# EAGLE schematic DDS_prototype (EAGLE 9.4.2)

## Sheet 1 of 2
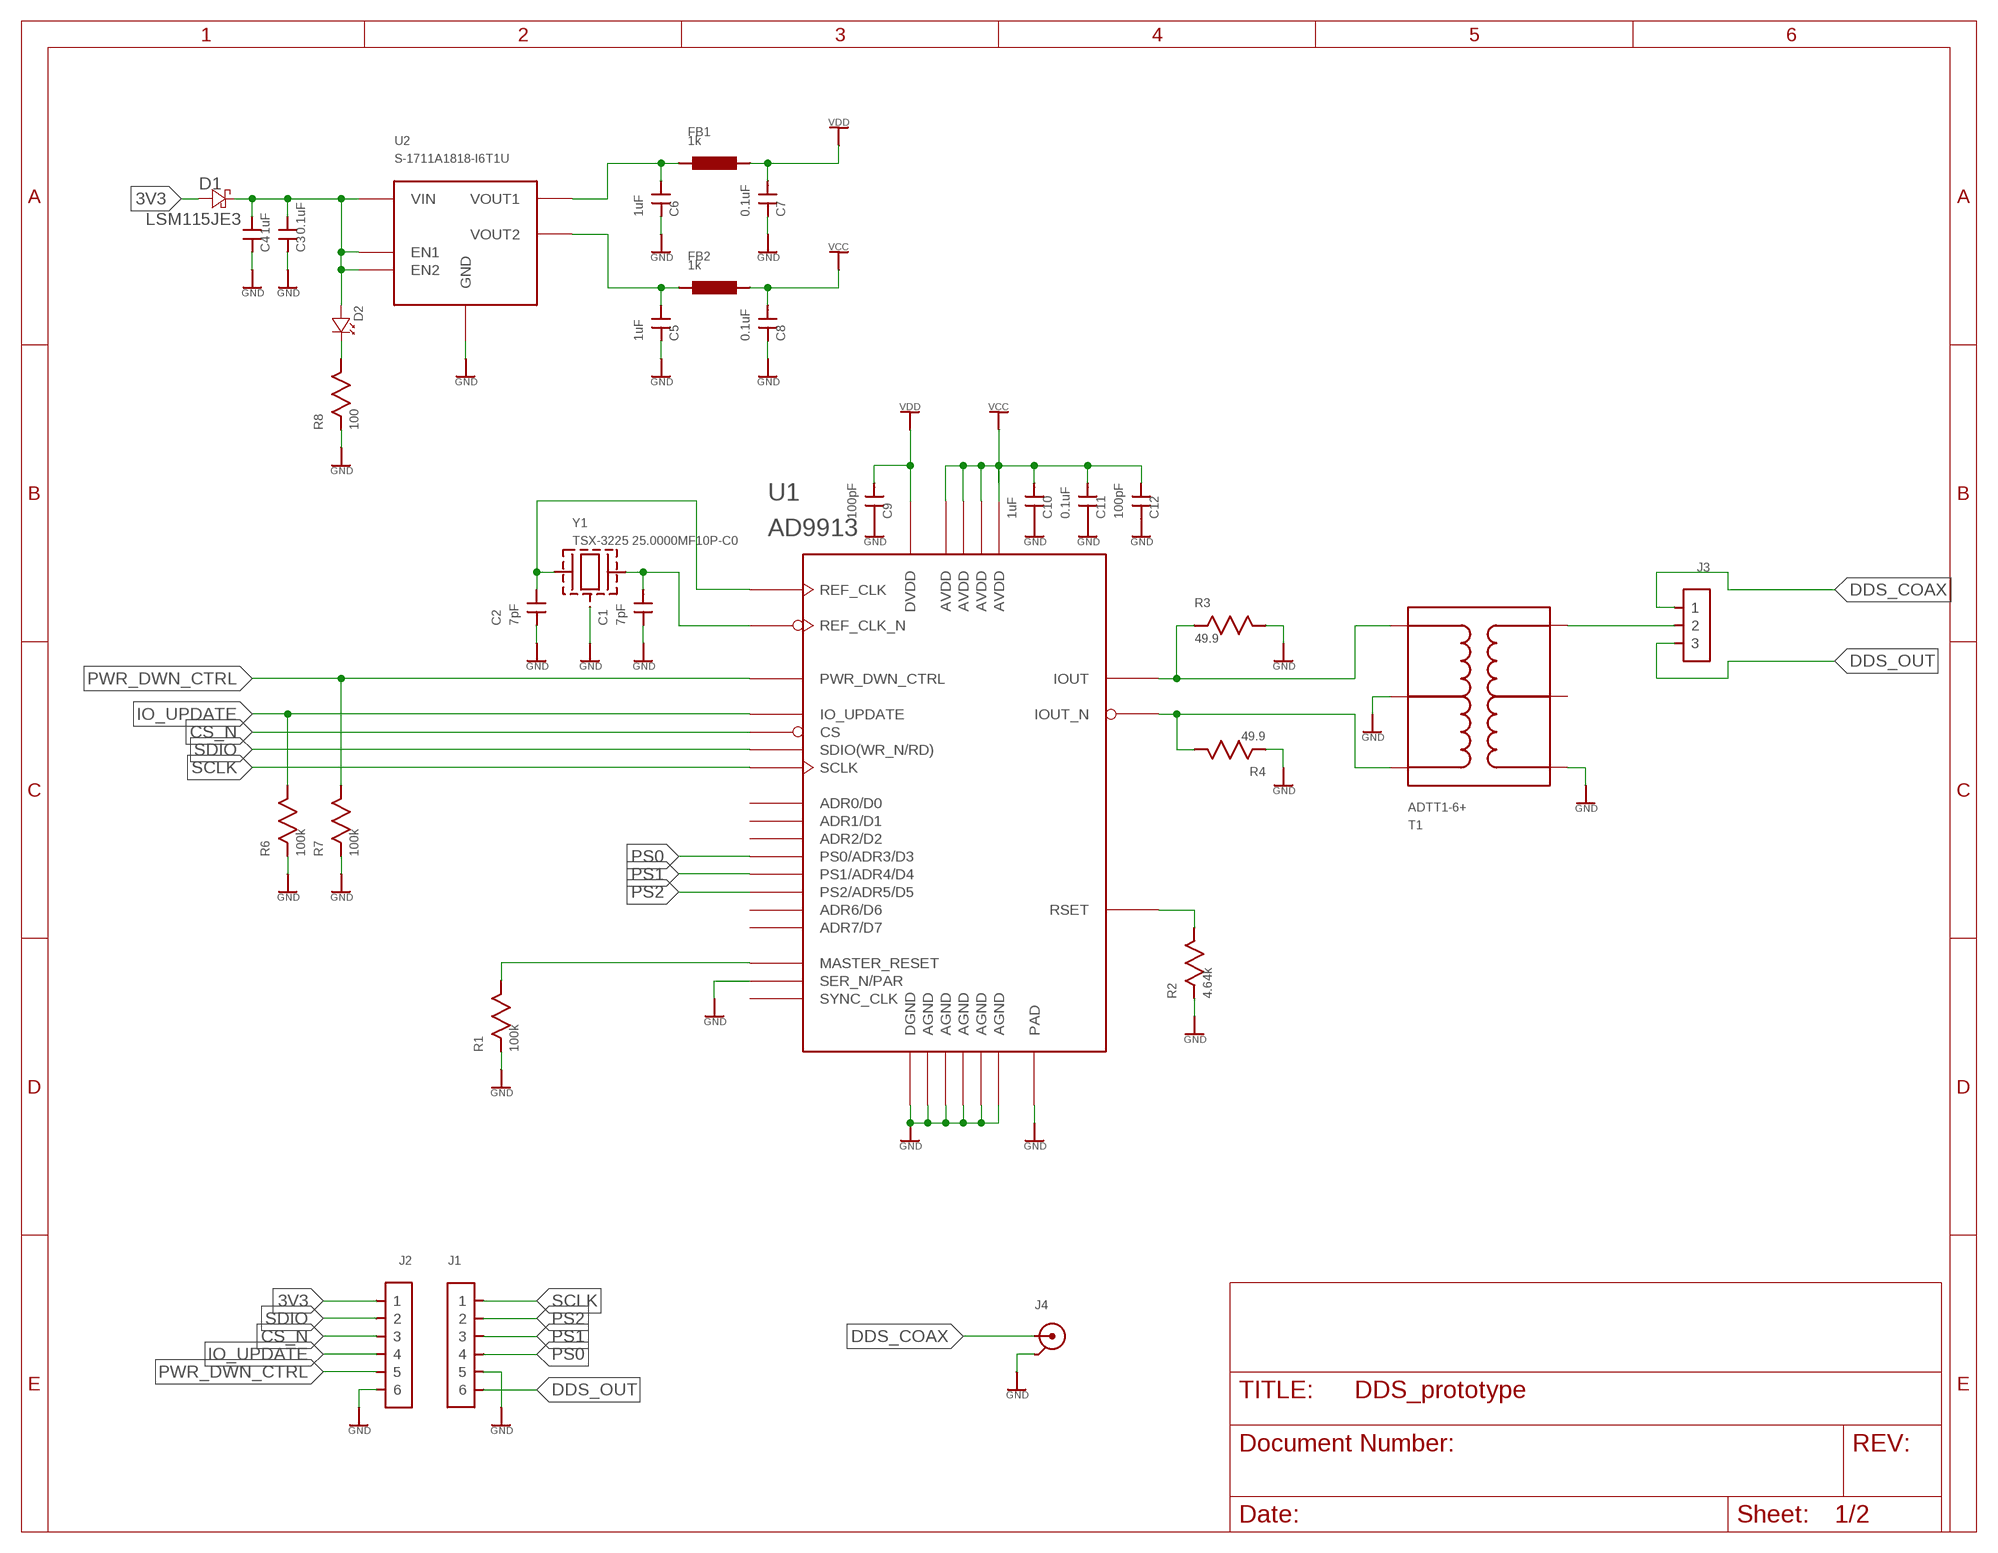
[diagram p0: schematic, sheet 1]

### Parts
C1  7pF  CC0402DRNPO9BN7R0  [0402]
C2  7pF  CC0402DRNPO9BN7R0  [0402]
C3  0.1uF  CC0402KRX5R7BB104  [0402]
C4  1uF  CC0402KRX5R7BB105  [0402]
C5  1uF  CC0402KRX5R7BB105  [0402]
C6  1uF  CC0402KRX5R7BB105  [0402]
C7  0.1uF  CC0402KRX5R7BB104  [0402]
C8  0.1uF  CC0402KRX5R7BB104  [0402]
C9  100pF  CC0402JRNPO9BN101  [0402]
C10  1uF  CC0402KRX5R7BB105  [0402]
C11  0.1uF  CC0402KRX5R7BB104  [0402]
C12  100pF  CC0402JRNPO9BN101  [0402]
D1  LSM115JE3  LSM115JE3/TR13  [DO-214BA]
D2  QBLP595-IG  [0402_GREEN]
FB1  1k  BLM18KG102SN1D  [0603]
FB2  1k  BLM18KG102SN1D  [0603]
J1  1X6_MALE_HEADER_0.1  [1X6_MALE_HEADER_0.1]
J2  1X6_MALE_HEADER_0.1  [1X6_MALE_HEADER_0.1]
J3  1X3_MALE_HEADER_0.1  [1X3_MALE_HEADER_0.1]
J4  SMA_EMPCB.SMAFSTJ.B.HT  [EMPCB.SMAFSTJ.B.HT]
R1  100k  RC0402JR-07100KL  [0402]
R2  4.64k  RC0402FR-074K64L  [0402]
R3  49.9  RC0402FR-0749R9L  [0402]
R4  49.9  RC0402FR-0749R9L  [0402]
R6  100k  RC0402JR-07100KL  [0402]
R7  100k  RC0402JR-07100KL  [0402]
R8  100  RC0402JR-07100RL  [0402]
T1  ADTT1-6+  [CD637]
U1  AD9913  [32-LFCSP]
U2  S-1711A1818-I6T1U  S-1711  [SNT-6A]
Y1  TSX-3225 25.0000MF10P-C0  TSX-322525.0000MF10P-C0  [TSX-3225]

### Nets
3V3: D1.A J2.P$1
3V3_PROT: C3.2 C4.2 D1.K D2.A U2.P2(VIN) U2.P4(EN2) U2.P6(EN1)
CS_N: J2.P$3 U1.P$28(CS)
DDS: J3.P$2 T1.P$4
DDS_COAX: J3.P$1 J4.P$1
DDS_OUT: J1.P$6 J3.P$3
GND: C1.1 C2.1 C3.1 C4.1 C5.1 C6.1 C7.1 C8.1 C9.1 C10.1 C11.1 C12.1 J1.P$5 J2.P$6 J4.P$2 J4.P$3 J4.P$4 J4.P$5 R1.P$1 R2.P$1 R3.P$2 R4.P$1 R6.P$1 R7.P$1 R8.P$1 T1.P$2 T1.P$6 U1.P$5(DGND) U1.P$10(SER_N/PAR) U1.P$11(AGND) U1.P$15(AGND) U1.P$18(AGND) U1.P$21(AGND) U1.P$23(AGND) U1.P$33(PAD) U2.P5(GND) Y1.P2 Y1.P4
IO_UPDATE: J2.P$4 R6.P$2 U1.P$27(IO_UPDATE)
IOUT: R3.P$1 T1.P$3 U1.P$19(IOUT)
IOUT_N: R4.P$2 T1.P$1 U1.P$20(IOUT_N)
MSTR_RST: R1.P$2 U1.P$25(MASTER_RESET)
N$1: D2.K R8.P$2
N$7: C1.2 U1.P$14(REF_CLK_N) Y1.P3
N$14: C2.2 U1.P$13(REF_CLK) Y1.P1
PS0: J1.P$4 U1.P$3(PS0/ADR3/D3)
PS1: J1.P$3 U1.P$2(PS1/ADR4/D4)
PS2: J1.P$2 U1.P$1(PS2/ADR5/D5)
PWR_DWN_CTRL: J2.P$5 R7.P$2 U1.P$26(PWR_DWN_CTRL)
RSET: R2.P$2 U1.P$24(RSET)
SCLK: J1.P$1 U1.P$30(SCLK)
SDIO: J2.P$2 U1.P$29(SDIO(WR_N/RD))
VCC: C8.2 C10.2 C11.2 C12.2 FB2.P$2 U1.P$12(AVDD) U1.P$16(AVDD) U1.P$17(AVDD) U1.P$22(AVDD)
VCC_UNFILT: C6.2 FB1.P$1 U2.P1(VOUT1)
VDD: C7.2 C9.2 FB1.P$2 U1.P$4(DVDD)
VDD_UNFILT: C5.2 FB2.P$1 U2.P3(VOUT2)
Unconnected: T1.P$5 U1.P$6(ADR2/D2) U1.P$7(ADR1/D1) U1.P$8(ADR0/D0) U1.P$9(SYNC_CLK) U1.P$31(ADR7/D7) U1.P$32(ADR6/D6)

## Sheet 2 of 2

## Library data of the parts
C1 C2 = Capacitors:CC0402DRNPO9BN7R0: CAP CER 7PF 50V C0G/NPO 0402; DIELECTRIC: NP0; SIZE: 0402; TOL: +/-0.5pF; VMAX: 50
C3 C7 C8 C11 = Capacitors:CC0402KRX5R7BB104: CAP CER 0.1UF 16V X5R 0402; DIELECTRIC: X5R; SIZE: 0402; TOL: 10%; VMAX: 16V
C4-C6 C10 = Capacitors:CC0402KRX5R7BB105: CAP CER 1UF 16V X5R 0402; DIELECTRIC: X5R; SIZE: 0402; TOL: 10%; VMAX: 16
C9 C12 = Capacitors:CC0402JRNPO9BN101: CAP CER 100PF 50V C0G/NPO 0402; DIELECTRIC: NP0; SIZE: 0402; TOL: +/-5%; VMAX: 50
D1 = Diodes:LSM115JE3/TR13: DIODE SCHOTTKY 15V 1A DO214BA; IMAX: 1A; SIZE: DO214BA; TYPE: Schottky; VR: 15
D2 = Diodes:QBLP595-IG: LED GREEN CLEAR 0402 SMD; COLOR: Green; SIZE: 0402
FB1 FB2 = Inductors:BLM18KG102SN1D: FERRITE BEAD 1 KOHM 0603 1LN; IMAX: 1A; SIZE: 0603
J1 J2 = Connectors:1X6_MALE_HEADER_0.1
J3 = Connectors:1X3_MALE_HEADER_0.1
J4 = Connectors:SMA_EMPCB.SMAFSTJ.B.HT
R1 R6 R7 = Resistors:RC0402JR-07100KL: RES SMD 100K OHM 5% 1/16W 0402; P_R: 1/16W; SIZE: 0402; TOL: 5%
R2 = Resistors:RC0402FR-074K64L: RES SMD 4.64K OHM 1% 1/16W 0402; P_R: 1/16W; SIZE: 0402; TOL: 1%
R3 R4 = Resistors:RC0402FR-0749R9L: RES SMD 49.9 OHM 1% 1/16W 0402; P_R: 1/16W; SIZE: 0402; TOL: 1%
R8 = Resistors:RC0402JR-07100RL: RES SMD 100 OHM 5% 1/16W 0402; P_R: 1/16W; SIZE: 0402; TOL: 5%
T1 = ICs:ADTT1-6+
U1 = ICs:AD9913
U2 = ICs:S-1711
Y1 = Crystals:TSX-322525.0000MF10P-C0: CRYSTAL 25.0000MHZ 18PF SMD; CAP: 7pF; FREQ: 25.0000MHz; TOL: 10ppm

## Net classes
0 default: clearance 0.205 mm